# EasyEDA Pro project flight controller.eprj

# Schematic fcbychandan
Board Name: fcbychandan; Create Date: 2025-07-17; Page Name: fcbychandan; Project Name: flight controller; Schematic Name: fcbychandan; Update Date: 2025-10-28; File: fcbychandan; Id: /; Sheet: /; Title: fc
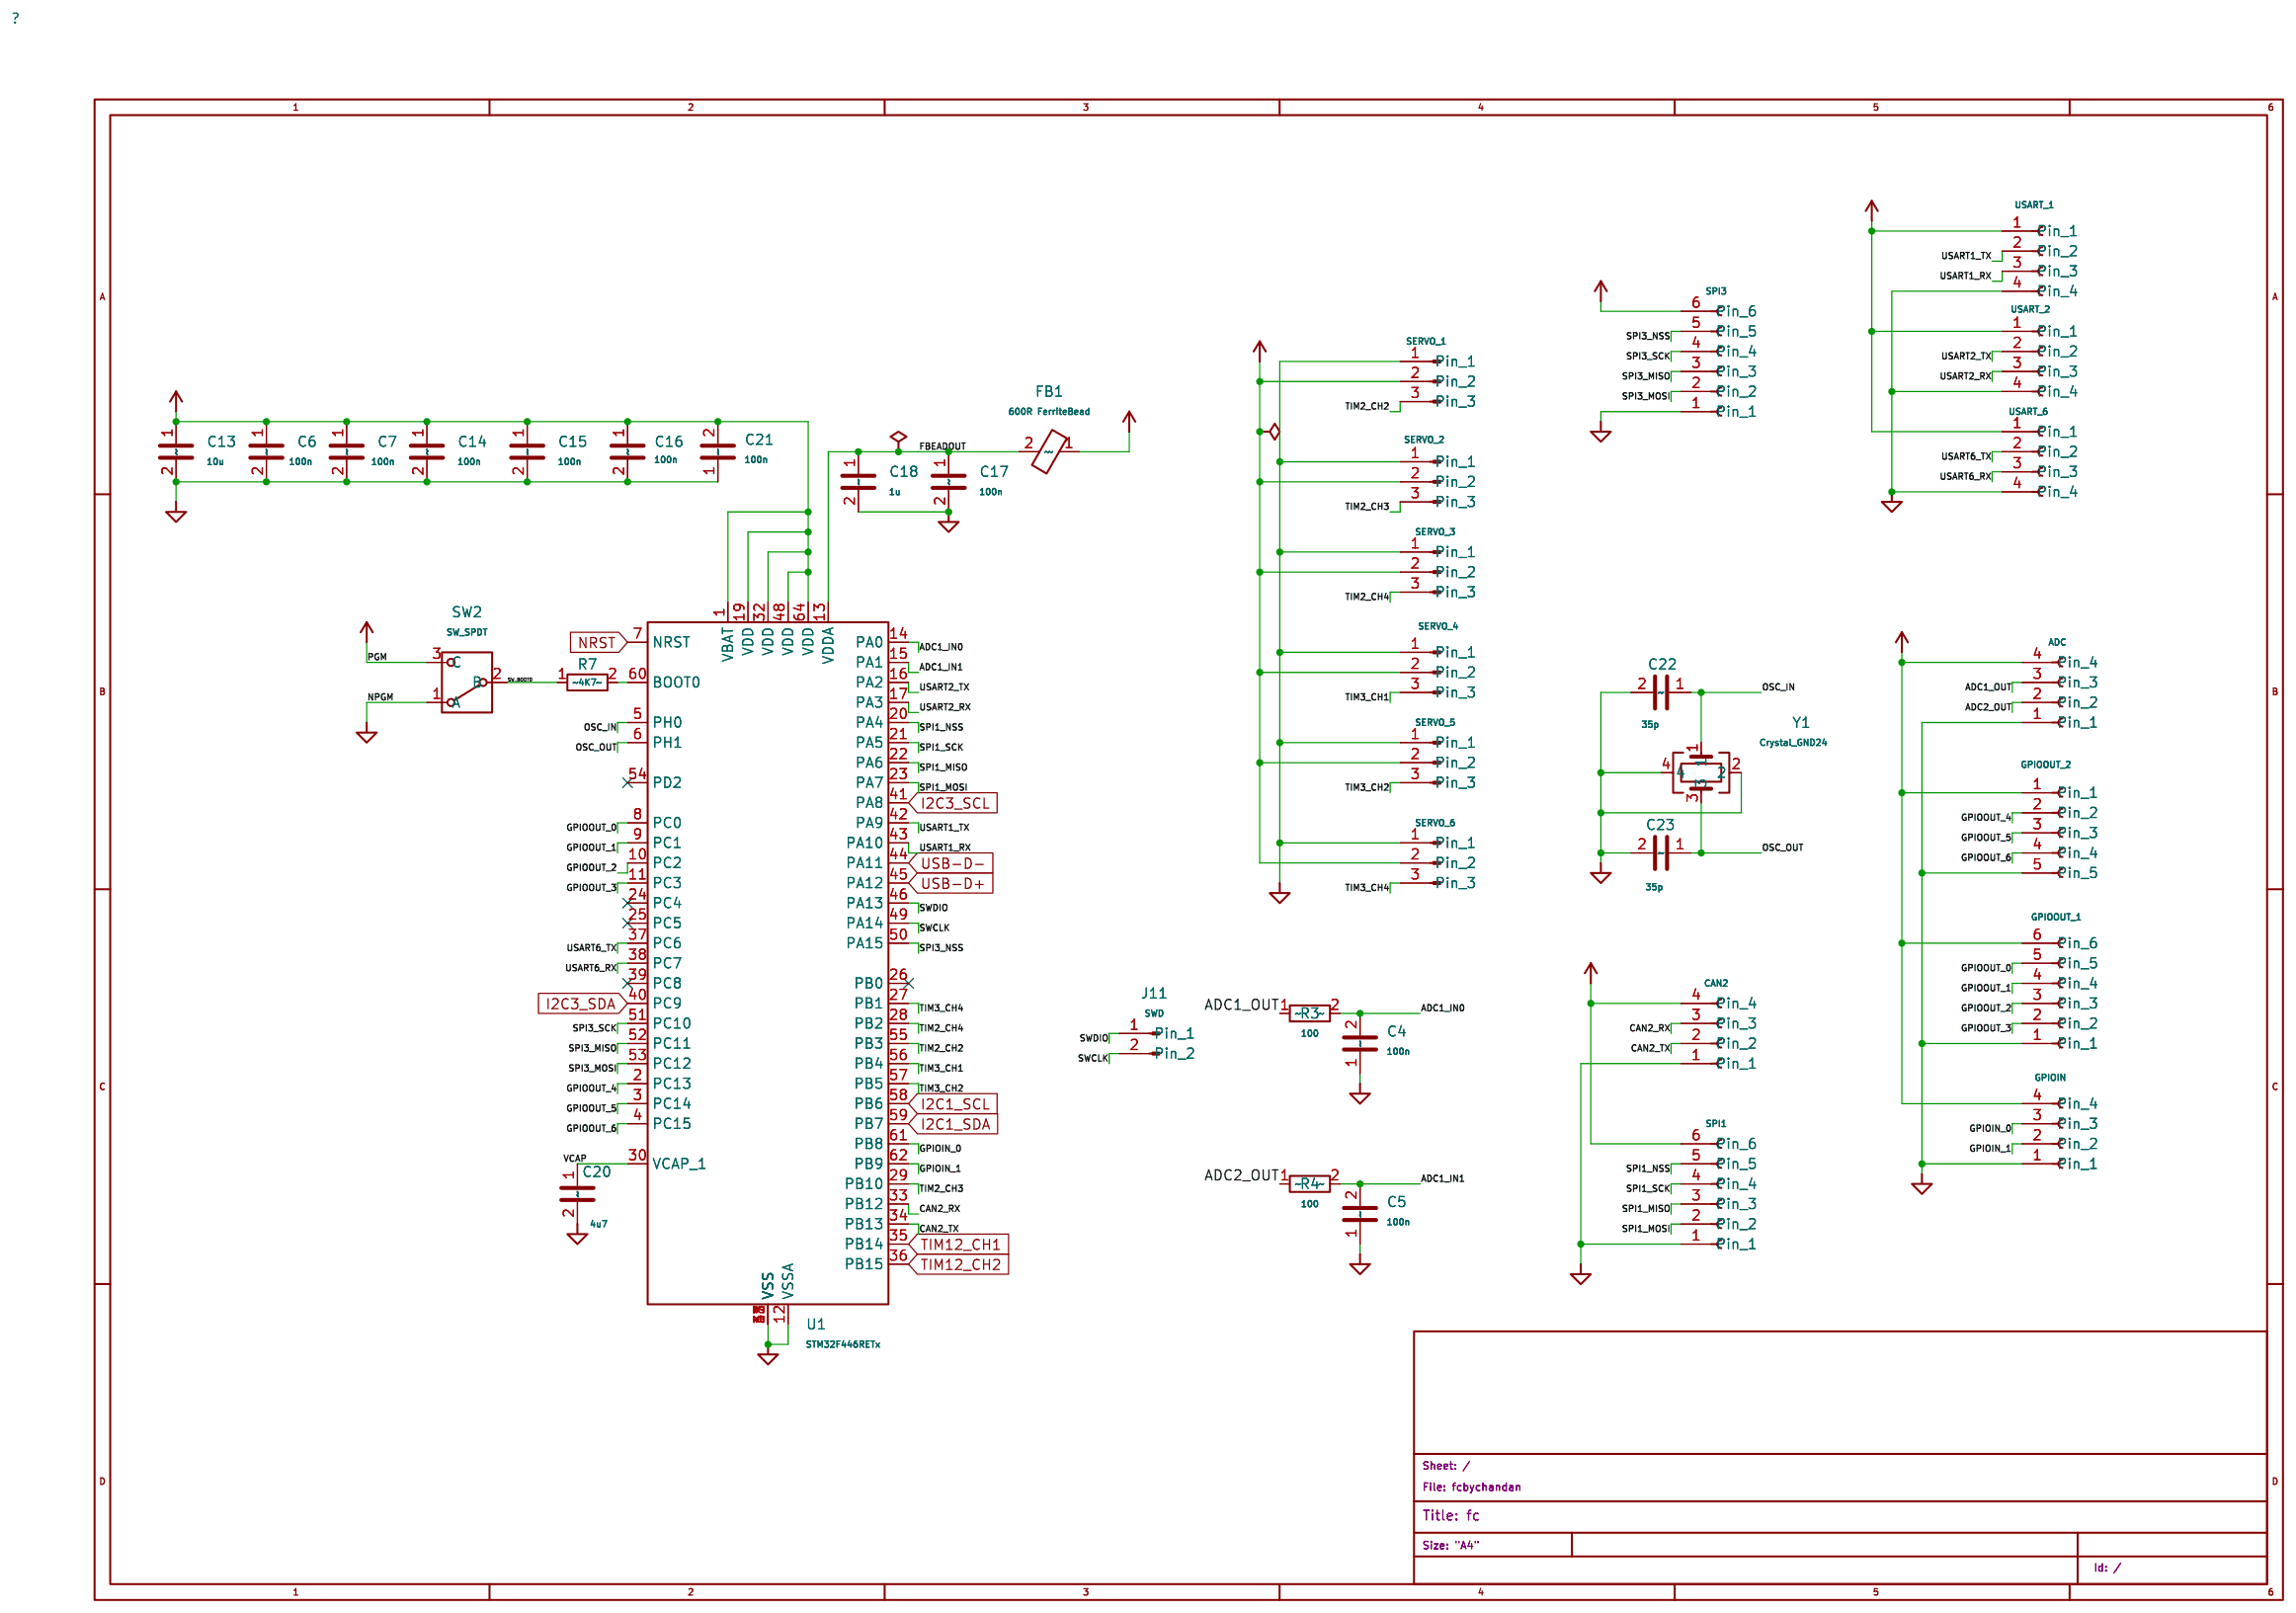
[diagram p0: schematic sheet]

## Parts
C4  100n
C5  100n
C6  100n
C7  100n
C13  10u
C14  100n
C15  100n
C16  100n
C17  100n
C18  1u
C20  4u7
C21  100n
C22  35p
C23  35p
FB1  600R FerriteBead
J1  SPI3
J2  GPIOOUT_1
J3  USART_1
J4  GPIOIN
J5  ADC
J6  USART_2
J7  USART_6
J8  SERVO_1
J9  SERVO_2
J10  GPIOOUT_2
J11  SWD
J12  SERVO_5
J13  SERVO_4
J14  SERVO_6
J15  SERVO_3
J17  SPI1
J18  CAN2
R3  100
R4  100
R7  4K7
SW2  SW_SPDT
U1  STM32F446RETx
Y1  Crystal_GND24

## Library data of the parts
C4-C7 C13-C18 C20-C23 = Device_C: Unpolarized capacitor
FB1 = Device_FerriteBead: Ferrite bead
J1 J2 J17 = Connector_Conn_01x06_Socket: Generic connector, single row, 01x06, script generated
J3-J7 J18 = Connector_Conn_01x04_Socket: Generic connector, single row, 01x04, script generated
J8 J9 J12-J15 = Connector_Conn_01x03_Pin: Generic connector, single row, 01x03, script generated
J10 = Connector_Conn_01x05_Socket: Generic connector, single row, 01x05, script generated
J11 = Connector_Conn_01x02_Pin: Generic connector, single row, 01x02, script generated
R3 R4 R7 = Device_R: Resistor
SW2 = Switch_SW_SPDT: Switch, single pole double throw
U1 = MCU_ST_STM32F4_STM32F446RETx: STMicroelectronics Arm Cortex-M4 MCU, 512KB flash, 128KB RAM, 180 MHz, 1.8-3.6V, 50 GPIO, LQFP64; User doc link: https://www.st.com/resource/en/datasheet/stm32f446re.pdf
Y1 = Device_Crystal_GND24: Four pin crystal, GND on pins 2 and 4

## Nets
ADC1_IN0: C4.2 R3.2 U1.14(PA0)
ADC1_IN1: C5.2 R4.2 U1.15(PA1)
ADC1_OUT: J5.3(Pin) R3.1
ADC2_OUT: J5.2(Pin) R4.1
CAN2_RX: J18.3(Pin) U1.33(PB12)
CAN2_TX: J18.2(Pin) U1.34(PB13)
GPIOIN_0: J4.3(Pin) U1.61(PB8)
GPIOIN_1: J4.2(Pin) U1.62(PB9)
GPIOOUT_0: J2.5(Pin) U1.8(PC0)
GPIOOUT_1: J2.4(Pin) U1.9(PC1)
GPIOOUT_2: J2.3(Pin) U1.10(PC2)
GPIOOUT_3: J2.2(Pin) U1.11(PC3)
GPIOOUT_4: J10.2(Pin) U1.2(PC13)
GPIOOUT_5: J10.3(Pin) U1.3(PC14)
GPIOOUT_6: J10.4(Pin) U1.4(PC15)
I2C1_SCL: U1.58(PB6)
I2C1_SDA: U1.59(PB7)
I2C3_SCL: U1.41(PA8)
I2C3_SDA: U1.40(PC9)
NRST: U1.7(NRST)
OSC_IN: C22.1 U1.5(PH0) Y1.1
OSC_OUT: C23.1 U1.6(PH1) Y1.3
POWER_+3.3V: J1.6(Pin) J2.6(Pin) J3.1(Pin) J4.4(Pin) J5.4(Pin) J6.1(Pin) J7.1(Pin) J10.1(Pin) J17.6(Pin) J18.4(Pin)
POWER_+3V3: C6.1 C7.1 C13.1 C14.1 C15.1 C16.1 C21.2 FB1.1 SW2.3(C) U1.1(VBAT) U1.19(VDD) U1.32(VDD) U1.48(VDD) U1.64(VDD)
POWER_+5V: C17.1 C18.1 FB1.2 J8.2(Pin) J9.2(Pin) J12.2(Pin) J13.2(Pin) J14.2(Pin) J15.2(Pin) U1.13(VDDA)
POWER_GND: C4.1 C5.1 C6.2 C7.2 C13.2 C14.2 C15.2 C16.2 C17.2 C18.2 C20.2 C21.1 C22.2 C23.2 J1.1(Pin) J2.1(Pin) J3.4(Pin) J4.1(Pin) J5.1(Pin) J6.4(Pin) J7.4(Pin) J8.1(Pin) J9.1(Pin) J10.5(Pin) J12.1(Pin) J13.1(Pin) J14.1(Pin) J15.1(Pin) J17.1(Pin) J18.1(Pin) SW2.1(A) U1.12(VSSA) U1.18(VSS) U1.31(VSS) U1.47(VSS) U1.63(VSS) Y1.2 Y1.4
SPI1_MISO: J17.3(Pin) U1.22(PA6)
SPI1_MOSI: J17.2(Pin) U1.23(PA7)
SPI1_NSS: J17.5(Pin) U1.20(PA4)
SPI1_SCK: J17.4(Pin) U1.21(PA5)
SPI3_MISO: J1.3(Pin) U1.52(PC11)
SPI3_MOSI: J1.2(Pin) U1.53(PC12)
SPI3_NSS: J1.5(Pin) U1.50(PA15)
SPI3_SCK: J1.4(Pin) U1.51(PC10)
SW_BOOT0: R7.1 SW2.2(B)
SWCLK: J11.2(Pin) U1.49(PA14)
SWDIO: J11.1(Pin) U1.46(PA13)
TIM2_CH2: J8.3(Pin) U1.55(PB3)
TIM2_CH3: J9.3(Pin) U1.29(PB10)
TIM2_CH4: J15.3(Pin) U1.28(PB2)
TIM3_CH1: J13.3(Pin) U1.56(PB4)
TIM3_CH2: J12.3(Pin) U1.57(PB5)
TIM3_CH4: J14.3(Pin) U1.27(PB1)
TIM12_CH1: U1.35(PB14)
TIM12_CH2: U1.36(PB15)
USART1_RX: J3.3(Pin) U1.43(PA10)
USART1_TX: J3.2(Pin) U1.42(PA9)
USART2_RX: J6.3(Pin) U1.17(PA3)
USART2_TX: J6.2(Pin) U1.16(PA2)
USART6_RX: J7.3(Pin) U1.38(PC7)
USART6_TX: J7.2(Pin) U1.37(PC6)
USB-D+: U1.45(PA12)
USB-D-: U1.44(PA11)
VCAP: C20.1 U1.30(VCAP_1)
Net-(R7-2): R7.2 U1.60(BOOT0)

Not connected (* = marked no-connect by the designer): U1 24(PC4)* 25(PC5)* 26(PB0)* 39(PC8)* 54(PD2)*

# Board fcbychandan
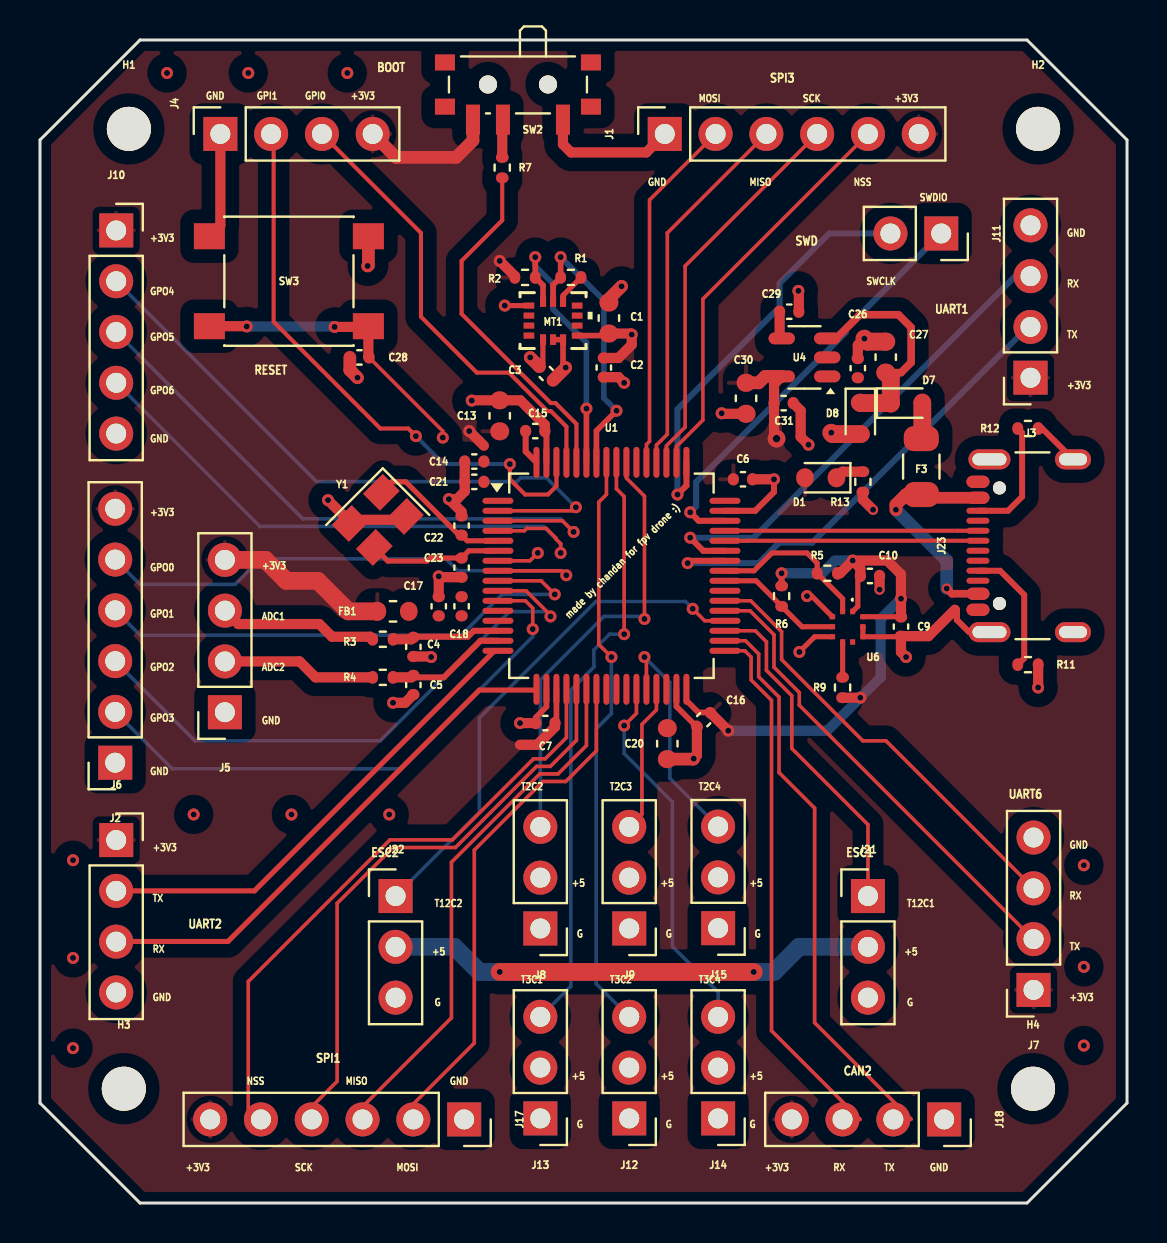
[diagram p1: board, top side]
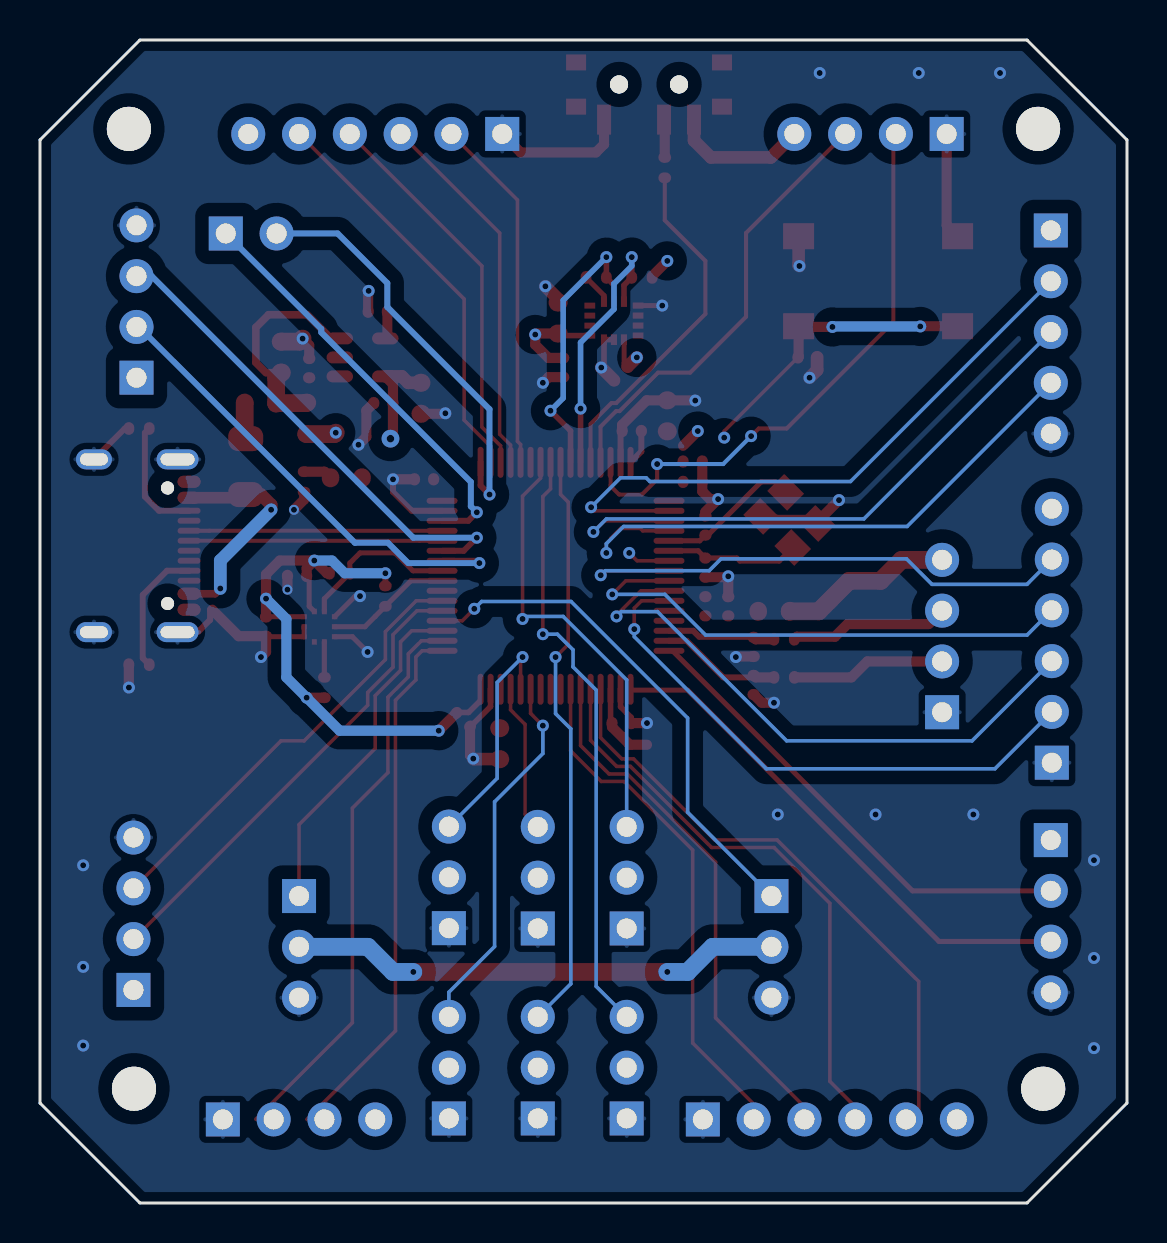
[diagram p2: board, bottom side, seen from below]

Outline 54.36 x 58.17 mm; copper layers: Top Layer, In1.Cu, In2.Cu, Bottom Layer. Coordinates in mm from the lower left corner of the outline.
Outline path: 0,53.17 5,58.17 49.36,58.17 54.36,53.17 54.36,5 49.36,0 5,0 0,5 0,53.17
Stack: Top Layer 0.0009mm / dielectric 1 0.0025mm FR4 er 4.5 / In1.Cu 0.0009mm / dielectric 2 0.0315mm FR4 er 4.5 / In2.Cu 0.0009mm / dielectric 3 0.0025mm FR4 er 4.5 / Bottom Layer 0.0009mm

## Design rules (mm)
spacing safeClearance (default): track to track 0.152, other pairs 0.152 to 0.3
track width trackWidth (default): min 0.127, default 0.254, max 2.54
differential pair differentialPair (default): width min 0.127, default 0.254, max 2.54; gap min 0.152, default 0.152
via viaSize (default): diameter min 0.5, default 0.61, max 10; hole min 0.3, default 0.305, max 6
net GND uses CopperRegion9
net /Fbeadout uses CopperRegion1
net /POWER SUPPLY/5Vin uses CopperRegion2
net 3V3 uses CopperRegion3
net /VCAP uses CopperRegion4
net VCC (+5) uses CopperRegion6
pour ie1435 uses CopperRegion
pour ie1436 uses CopperRegion8
pour ie1437 uses CopperRegion7
pour ie1439 uses CopperRegion2
pour ie1441 uses CopperRegion1
pour ie1442 uses CopperRegion4

## Placement (name value [footprint] x y rotation side)
C1  2u2  [Capacitor_SMD:C_0603_1608Metric]  28.45 44.26 90 top
C2  100n  [Capacitor_SMD:C_0402_1005Metric]  28.19 41.78 270 top
C3  10n  [Capacitor_SMD:C_0402_1005Metric]  25.31 41.49 315 top
C4  100n  [Capacitor_SMD:C_0402_1005Metric]  18.67 27.81 90 top
C5  100n  [Capacitor_SMD:C_0402_1005Metric]  18.67 25.91 90 top
C6  100n  [Capacitor_SMD:C_0402_1005Metric]  35.15 36.19 0 top
C7  100n  [Capacitor_SMD:C_0402_1005Metric]  25.27 24 180 top
C9  100n  [Capacitor_SMD:C_0402_1005Metric]  43.05 28.83 270 top
C10  100n  [Capacitor_SMD:C_0402_1005Metric]  41.5 31.36 0 top
C13  10u  [Capacitor_SMD:C_0603_1608Metric]  22.99 39.37 90 top
C14  100n  [Capacitor_SMD:C_0402_1005Metric]  21.72 37.08 180 top
C15  100n  [Capacitor_SMD:C_0402_1005Metric]  24.77 38.61 0 top
C16  100n  [Capacitor_SMD:C_0402_1005Metric]  33.19 24.17 225 top
C17  100n  [Capacitor_SMD:C_0402_1005Metric]  19.94 29.84 90 top
C18  1u  [Capacitor_SMD:C_0402_1005Metric]  21.08 29.84 90 top
C20  4u7  [Capacitor_SMD:C_0603_1608Metric]  31.37 22.97 270 top
C21  100n  [Capacitor_SMD:C_0402_1005Metric]  21.72 36.07 0 top
C22  35p  [Capacitor_SMD:C_0402_1005Metric]  21.08 33.88 90 top
C23  35p  [Capacitor_SMD:C_0402_1005Metric]  21.08 31.78 270 top
C26  100n  [Capacitor_SMD:C_0402_1005Metric]  40.89 41.75 90 top
C27  2u2  [Capacitor_SMD:C_0603_1608Metric]  42.29 42.3 90 top
C28  100n  [Capacitor_SMD:C_0402_1005Metric]  15.97 42.29 180 top
C29  10n  [Capacitor_SMD:C_0402_1005Metric]  37.46 44.58 0 top
C30  2u2  [Capacitor_SMD:C_0603_1608Metric]  35.31 40.25 270 top
C31  100n  [Capacitor_SMD:C_0402_1005Metric]  37.19 40 0 top
D1  GRN  [LED_SMD:LED_0603_1608Metric]  39.04 36.27 180 top
D7  B120-E3  [Diode_SMD:D_0603_1608Metric]  43.33 40 0 top
D8  B120-E3  [Diode_SMD:D_0603_1608Metric]  41.02 39.24 270 top
F3  Fuse  [Fuse:Fuse_1206_3216Metric]  44.07 36.83 270 top
FB1  600R FerriteBead  [Inductor_SMD:L_0603_1608Metric]  17.65 29.59 0 top
H1  MountingHole  [MountingHole:MountingHole_2.2mm_M2]  4.45 53.72 0 top
H2  MountingHole  [MountingHole:MountingHole_2.2mm_M2]  49.91 53.72 0 top
H3  MountingHole  [MountingHole:MountingHole_2.2mm_M2]  4.19 5.72 0 top
H4  MountingHole  [MountingHole:MountingHole_2.2mm_M2]  49.66 5.72 0 top
J1  SPI3  [Connector_PinSocket_2.54mm:PinSocket_1x06_P2.54mm_Vertical]  31.24 53.47 90 top
J2  GPIOOUT_1  [Connector_PinSocket_2.54mm:PinSocket_1x06_P2.54mm_Vertical]  3.76 22.02 180 top
J3  USART_1  [Connector_PinSocket_2.54mm:PinSocket_1x04_P2.54mm_Vertical]  49.53 41.28 180 top
J4  GPIOIN  [Connector_PinSocket_2.54mm:PinSocket_1x04_P2.54mm_Vertical]  9.02 53.47 90 top
J5  ADC  [Connector_PinSocket_2.54mm:PinSocket_1x04_P2.54mm_Vertical]  9.25 24.55 180 top
J6  USART_2  [Connector_PinSocket_2.54mm:PinSocket_1x04_P2.54mm_Vertical]  3.81 18.15 0 top
J7  USART_6  [Connector_PinSocket_2.54mm:PinSocket_1x04_P2.54mm_Vertical]  49.68 10.66 180 top
J8  SERVO_1  [Connector_PinHeader_2.54mm:PinHeader_1x03_P2.54mm_Vertical]  25.02 13.73 180 top
J9  SERVO_2  [Connector_PinHeader_2.54mm:PinHeader_1x03_P2.54mm_Vertical]  29.46 13.73 180 top
J10  GPIOOUT_2  [Connector_PinSocket_2.54mm:PinSocket_1x05_P2.54mm_Vertical]  3.81 48.64 0 top
J11  SWD  [Connector_PinSocket_2.54mm:PinSocket_1x02_P2.54mm_Vertical]  45.07 48.49 270 top
J12  SERVO_5  [Connector_PinHeader_2.54mm:PinHeader_1x03_P2.54mm_Vertical]  29.46 4.23 180 top
J13  SERVO_4  [Connector_PinHeader_2.54mm:PinHeader_1x03_P2.54mm_Vertical]  25.02 4.23 180 top
J14  SERVO_6  [Connector_PinHeader_2.54mm:PinHeader_1x03_P2.54mm_Vertical]  33.91 4.23 180 top
J15  SERVO_3  [Connector_PinHeader_2.54mm:PinHeader_1x03_P2.54mm_Vertical]  33.91 13.75 180 top
J17  SPI1  [Connector_PinSocket_2.54mm:PinSocket_1x06_P2.54mm_Vertical]  21.21 4.18 270 top
J18  CAN2  [Connector_PinSocket_2.54mm:PinSocket_1x04_P2.54mm_Vertical]  45.21 4.18 270 top
J21  B1_IN  [Connector_PinHeader_2.54mm:PinHeader_1x03_P2.54mm_Vertical]  41.4 15.35 0 top
J22  B2_IN  [Connector_PinHeader_2.54mm:PinHeader_1x03_P2.54mm_Vertical]  17.78 15.35 0 top
J23  USB_IN  [Connector_USB:USB_C_Receptacle_GCT_USB4105-xx-A_16P_TopMnt_Horizontal]  50.58 32.87 90 top
MT1  ICM-42670-P  [Littelfuse_poly:LGA14_2.5X3X0.76_IVS]  25.65 44.13 0 top
R1  10K  [Resistor_SMD:R_0402_1005Metric]  26.54 46.29 180 top
R2  10K  [Resistor_SMD:R_0402_1005Metric]  24.26 46.29 0 top
R3  100  [Resistor_SMD:R_0402_1005Metric]  17.14 28.19 0 top
R4  100  [Resistor_SMD:R_0402_1005Metric]  17.14 26.29 0 top
R5  4K7  [Resistor_SMD:R_0402_1005Metric]  39.37 31.5 180 top
R6  4K7  [Resistor_SMD:R_0402_1005Metric]  37.08 30.35 90 top
R7  4K7  [Resistor_SMD:R_0402_1005Metric]  23.11 51.78 270 top
R9  100K  [Resistor_SMD:R_0402_1005Metric]  40.13 25.78 270 top
R11  4K7  [Resistor_SMD:R_0402_1005Metric]  49.4 26.92 0 top
R12  4K7  [Resistor_SMD:R_0402_1005Metric]  49.4 38.73 0 top
R13  4K7  [Resistor_SMD:R_0402_1005Metric]  41.15 36.07 270 top
SW2  SW_SPDT  [Button_Switch_SMD:SW_SPDT_PCM12]  23.9 55.61 180 top
SW3  SW_Push  [Button_Switch_SMD:SW_Push_1P1T_NO_6x6mm_H9.5mm]  12.45 46.1 0 top
U1  STM32F446RETx  [Package_QFP:LQFP-64_10x10mm_P0.5mm]  28.58 31.37 0 top
U4  3V3  [Package_TO_SOT_SMD:SOT-23-5]  38.23 42.29 180 top
U6  BMP390  [Littelfuse_poly:BMP390]  40.39 28.82 0 top
Y1  Crystal_GND24  [Crystal:Crystal_SMD_3225-4Pin_3.2x2.5mm]  16.89 34.16 225 top

## Footprints (pads in the part's own frame, mm; a bottom-side part is the same pattern mirrored in y, then rotated)
Button_Switch_SMD:SW_Push_1P1T_NO_6x6mm_H9.5mm
  rect 1.55x1.3 smd: 1(-3.975,2.25) 1(3.975,2.25) 2(-3.975,-2.25) 2(3.975,-2.25)
Button_Switch_SMD:SW_SPDT_PCM12
  rect 1x0.8 smd: (-3.65,0.78) (-3.65,-1.43) (3.65,0.78) (3.65,-1.43)
  round 0.9 hole 0.9: (-1.5,-0.33) (1.5,-0.33)
  rect 0.7x1.5 smd: 1(-2.25,1.43) 2(0.75,1.43) 3(2.25,1.43)
Capacitor_SMD:C_0402_1005Metric
  rrect 0.56x0.62 smd: 1(-0.48,0) 2(0.48,0)
Capacitor_SMD:C_0603_1608Metric
  rrect 0.9x0.95 smd: 1(-0.775,0) 2(0.775,0)
Connector_PinHeader_2.54mm:PinHeader_1x03_P2.54mm_Vertical
  rect 1.7x1.7 hole 1: 1(0,0)
  round 1.7 hole 1: 2(0,-2.54) 3(0,-5.08)
Connector_PinSocket_2.54mm:PinSocket_1x02_P2.54mm_Vertical
  rect 1.7x1.7 hole 1: 1(0,0)
  round 1.7 hole 1: 2(0,-2.54)
Connector_PinSocket_2.54mm:PinSocket_1x04_P2.54mm_Vertical
  rect 1.7x1.7 hole 1: 1(0,0)
  round 1.7 hole 1: 2(0,-2.54) 3(0,-5.08) 4(0,-7.62)
Connector_PinSocket_2.54mm:PinSocket_1x05_P2.54mm_Vertical
  rect 1.7x1.7 hole 1: 1(0,0)
  round 1.7 hole 1: 2(0,-2.54) 3(0,-5.08) 4(0,-7.62) 5(0,-10.16)
Connector_PinSocket_2.54mm:PinSocket_1x06_P2.54mm_Vertical
  rect 1.7x1.7 hole 1: 1(0,0)
  round 1.7 hole 1: 2(0,-2.54) 3(0,-5.08) 4(0,-7.62) 5(0,-10.16) 6(0,-12.7)
Connector_USB:USB_C_Receptacle_GCT_USB4105-xx-A_16P_TopMnt_Horizontal
  round 0.65 hole 0.65: (-2.89,2.605) (2.89,2.605)
  rrect 0.6x1.15 smd: A1(-3.2,3.68) A4(-2.4,3.68) A9(2.4,3.68) A12(3.2,3.68) B1(3.2,3.68) B4(2.4,3.68) B9(-2.4,3.68) B12(-3.2,3.68)
  rrect 0.3x1.15 smd: A5(-1.25,3.68) A6(-0.25,3.68) A7(0.25,3.68) A8(1.25,3.68) B5(1.75,3.68) B6(0.75,3.68) B7(-0.75,3.68) B8(-1.75,3.68)
  oval 1x2.1 hole 0.6x1.7: S1(-4.32,3.105) S1(4.32,3.105)
  oval 1x1.8 hole 0.6x1.4: S1(-4.32,-1.075) S1(4.32,-1.075)
Crystal:Crystal_SMD_3225-4Pin_3.2x2.5mm
  rect 1.4x1.2 smd: 1(-1.1,-0.85) 2(1.1,-0.85) 3(1.1,0.85) 4(-1.1,0.85)
Diode_SMD:D_0603_1608Metric
  rrect 0.875x0.95 smd: 1(-0.787,0) 2(0.787,0)
Fuse:Fuse_1206_3216Metric
  rrect 1.25x1.75 smd: 1(-1.4,0) 2(1.4,0)
Inductor_SMD:L_0603_1608Metric
  rrect 0.875x0.95 smd: 1(-0.787,0) 2(0.787,0)
LED_SMD:LED_0603_1608Metric
  rrect 0.875x0.95 smd: 1(-0.787,0) 2(0.787,0)
Littelfuse_poly:BMP390
  rect 0.25x0.275 smd: 1(0.25,0.763) 2(-0.25,0.763) 6(-0.25,-0.763) 7(0.25,-0.763)
  rect 0.275x0.25 smd: 3(-0.762,0.5) 4(-0.762,0) 5(-0.762,-0.5) 8(0.762,-0.5) 9(0.762,0) 10(0.762,0.5)
Littelfuse_poly:LGA14_2.5X3X0.76_IVS
  rect 0.533x0.305 smd: 1(-1.206,0.75) 2(-1.206,0.25) 3(-1.206,-0.25) 4(-1.206,-0.75) 8(1.206,-0.75) 9(1.206,-0.25) 10(1.206,0.25) 11(1.206,0.75)
  rect 0.305x0.533 smd: 5(-0.5,-0.953) 6(0,-0.953) 7(0.5,-0.953) 12(0.5,0.953) 13(0,0.953) 14(-0.5,0.953)
MountingHole:MountingHole_2.2mm_M2
  round 2.2 hole 2.2: (0,0)
Package_QFP:LQFP-64_10x10mm_P0.5mm
  rrect 1.55x0.3 smd: 1(-5.675,3.75) 2(-5.675,3.25) 3(-5.675,2.75) 4(-5.675,2.25) 5(-5.675,1.75) 6(-5.675,1.25) 7(-5.675,0.75) 8(-5.675,0.25) 9(-5.675,-0.25) 10(-5.675,-0.75) 11(-5.675,-1.25) 12(-5.675,-1.75) 13(-5.675,-2.25) 14(-5.675,-2.75) 15(-5.675,-3.25) 16(-5.675,-3.75) 33(5.675,-3.75) 34(5.675,-3.25) 35(5.675,-2.75) 36(5.675,-2.25) 37(5.675,-1.75) 38(5.675,-1.25) 39(5.675,-0.75) 40(5.675,-0.25) 41(5.675,0.25) 42(5.675,0.75) 43(5.675,1.25) 44(5.675,1.75) 45(5.675,2.25) 46(5.675,2.75) 47(5.675,3.25) 48(5.675,3.75)
  rrect 0.3x1.55 smd: 17(-3.75,-5.675) 18(-3.25,-5.675) 19(-2.75,-5.675) 20(-2.25,-5.675) 21(-1.75,-5.675) 22(-1.25,-5.675) 23(-0.75,-5.675) 24(-0.25,-5.675) 25(0.25,-5.675) 26(0.75,-5.675) 27(1.25,-5.675) 28(1.75,-5.675) 29(2.25,-5.675) 30(2.75,-5.675) 31(3.25,-5.675) 32(3.75,-5.675) 49(3.75,5.675) 50(3.25,5.675) 51(2.75,5.675) 52(2.25,5.675) 53(1.75,5.675) 54(1.25,5.675) 55(0.75,5.675) 56(0.25,5.675) 57(-0.25,5.675) 58(-0.75,5.675) 59(-1.25,5.675) 60(-1.75,5.675) 61(-2.25,5.675) 62(-2.75,5.675) 63(-3.25,5.675) 64(-3.75,5.675)
Package_TO_SOT_SMD:SOT-23-5
  rrect 1.325x0.6 smd: 1(-1.137,0.95) 2(-1.137,0) 3(-1.137,-0.95) 4(1.137,-0.95) 5(1.137,0.95)
Resistor_SMD:R_0402_1005Metric
  rrect 0.54x0.64 smd: 1(-0.51,0) 2(0.51,0)

## Nets
3V3: C1.1 C2.1 C3.1 C6.1 C7.1 C9.1 C10.1 C13.1 C14.1 C15.1 C16.1 C21.2 C30.1 C31.1 D1.2 FB1.1 J1.6 J2.6 J3.1 J4.4 J5.4 J6.1 J7.1 J10.1 J17.6 J18.4 MT1.5 MT1.8 MT1.12 R1.1 R2.1 R5.1 R6.2 R9.2 SW2.3 U1.1 U1.19 U1.32 U1.48 U1.64 U4.5 U6.1 U6.10
/POWER SUPPLY/5VIN: C26.1 C27.1 D7.1 D8.1 U4.1 U4.3
/POWER SUPPLY/5VUSB: F3.2 J23.A4 J23.A9 J23.B4 J23.B9
GND: C1.2 C2.2 C3.2 C4.1 C5.1 C6.2 C7.2 C9.2 C10.2 C13.2 C14.2 C15.2 C16.2 C17.2 C18.2 C20.2 C21.1 C22.2 C23.2 C26.2 C27.2 C28.2 C29.2 C30.2 C31.2 J1.1 J2.1 J3.4 J4.1 J5.1 J6.4 J7.4 J8.1 J9.1 J10.5 J12.1 J13.1 J14.1 J15.1 J17.1 J18.1 J21.3 J22.3 J23.A1 J23.A12 J23.B1 J23.B12 J23.S1 MT1.1 MT1.6 MT1.7 R11.2 R12.2 R13.2 SW2.1 SW3.1 U1.12 U1.18 U1.31 U1.47 U1.63 U4.2 U6.3 U6.5 U6.8 U6.9 Y1.2 Y1.4
VCC (+5): D8.2 J8.2 J9.2 J12.2 J13.2 J14.2 J15.2 J21.2 J22.2
/ADC1_IN0: C4.2 R3.2 U1.14
/ADC1_IN1: C5.2 R4.2 U1.15
/ADC1_OUT: J5.3 R3.1
/ADC2_OUT: J5.2 R4.1
/CAN2_RX: J18.3 U1.33
/CAN2_TX: J18.2 U1.34
/FBEADOUT: C17.1 C18.1 FB1.2 U1.13
/GPIOIN_0: J4.3 U1.61
/GPIOIN_1: J4.2 U1.62
/GPIOOUT_0: J2.5 U1.8
/GPIOOUT_1: J2.4 U1.9
/GPIOOUT_2: J2.3 U1.10
/GPIOOUT_3: J2.2 U1.11
/GPIOOUT_4: J10.2 U1.2
/GPIOOUT_5: J10.3 U1.3
/GPIOOUT_6: J10.4 U1.4
/OSC_IN: C22.1 U1.5 Y1.1
/OSC_OUT: C23.1 U1.6 Y1.3
/POWER SUPPLY/BP: C29.1 U4.4
/POWER SUPPLY/CC1USB: J23.A5 R11.1
/POWER SUPPLY/CC2USB: J23.B5 R12.1
/SPI1_MISO: J17.3 U1.22
/SPI1_MOSI: J17.2 U1.23
/SPI1_NSS: J17.5 U1.20
/SPI1_SCK: J17.4 U1.21
/SPI3_MISO: J1.3 U1.52
/SPI3_MOSI: J1.2 U1.53
/SPI3_NSS: J1.5 U1.50
/SPI3_SCK: J1.4 U1.51
/SW_BOOT0: R7.1 SW2.2
/SWCLK: J11.2 U1.49
/SWDIO: J11.1 U1.46
/TIM2_CH2: J8.3 U1.55
/TIM2_CH3: J9.3 U1.29
/TIM2_CH4: J15.3 U1.28
/TIM3_CH1: J13.3 U1.56
/TIM3_CH2: J12.3 U1.57
/TIM3_CH4: J14.3 U1.27
/USART1_RX: J3.3 U1.43
/USART1_TX: J3.2 U1.42
/USART2_RX: J6.3 U1.17
/USART2_TX: J6.2 U1.16
/USART6_RX: J7.3 U1.38
/USART6_TX: J7.2 U1.37
/VCAP: C20.1 U1.30
I2C1_SCL: MT1.13 R1.2 U1.58
I2C1_SDA: MT1.14 R2.2 U1.59
I2C3_SCL: R5.2 U1.41 U6.2
I2C3_SDA: R6.1 U1.40 U6.4
NET-(D1-K): D1.1 R13.1
NET-(D7-A): D7.2 F3.1
NET-(U1-BOOT0): R7.2 U1.60
NET-(U6-CSB): R9.1 U6.6
NRST: C28.1 SW3.2 U1.7
TIM12_CH1: J21.1 U1.35
TIM12_CH2: J22.1 U1.36
UNCONNECTED-(MT1-INT1{SLASH}INT-PAD4): MT1.4
UNCONNECTED-(MT1-INT2-PAD9): MT1.9
UNCONNECTED-(MT1-RESV-PAD2): MT1.2
UNCONNECTED-(MT1-RESV__1-PAD3): MT1.3
UNCONNECTED-(MT1-RESV__2-PAD10): MT1.10
UNCONNECTED-(MT1-RESV__3-PAD11): MT1.11
UNCONNECTED-(U1-PB0-PAD26): U1.26
UNCONNECTED-(U1-PC4-PAD24): U1.24
UNCONNECTED-(U1-PC5-PAD25): U1.25
UNCONNECTED-(U1-PC8-PAD39): U1.39
UNCONNECTED-(U1-PD2-PAD54): U1.54
UNCONNECTED-(U6-INT-PAD7): U6.7
USB-D+: J23.A6 J23.B6 U1.45
USB-D-: J23.A7 J23.B7 U1.44

Pads without a net: J23 A8 B8

## Via types
v1: diameter 0.6, hole 0.3, Top Layer to Bottom Layer, 74 vias
v2: diameter 0.5, hole 0.3, Top Layer to Bottom Layer, 4 vias
v3: diameter 0.889, hole 0.381, Top Layer to Bottom Layer, 1 via

## Routing (per net, layer and track width the routed paths; a pad name or vN(x,y) marks a point on that pad's centre or on a via; arc(x,y) is an arc through that point)
3V3: length 294.7
  Top Layer w0.254: U6.10 43.04,29.32 ; R1.1 26.15,45.39 MT1.12 ; U6.1 40.89,29.84 40.89,31.23 ; 25.15,43.17 25.15,42 C3.1
  Top Layer w0.28: 32.33,25.13 32.92,24.53 33.51,24.53 ; MT1.8 28.35,43.38 ; 25.83,24.08 U1.19
  Top Layer w0.297: C15.1 24.29,37.58 U1.64
  Top Layer w0.305: R6.2 v1(37.08,31.5)
  Top Layer w0.508: C1.1 29.54,43.48 v1(29.59,43.43) 29.59,42.93 28.93,42.26 C2.1 ; v1(40.64,32.13) 42.36,32.13 43.05,31.44 v1(43.05,30.23) C9.1 ; v1(40.64,32.13) 40.01,31.5 R5.1 ; v1(40.64,32.13) 41.02,31.75 C10.1 ; v1(41.02,25.27) 41.02,25.27 R9.2 ; v1(21.46,38.61) 22.2,37.87 ; C7.1 25.75,23.81 24.86,22.92 24,22.92 ; v3(36.83,38.23) 36.71,38.35 C31.1 36.71,40.96 U4.5 ; C16.1 v1(34.42,23.62) ; 23.74,46.36 v1(22.99,47.12)
  Top Layer w0.635: U4.5 36.26,41.34 35.94,41.02 C30.1 ; SW2.3 21.65,53.14 20.8,52.29 17.81,52.29 J4.4 ; C3.1 v1(24.51,42.29)
  Top Layer w0.889: J5.4 11.27,32.17 12.32,31.11 13.89,31.11 15.42,29.59 FB1.1
  In2.Cu w0.508: v1(21.46,38.61) 18.67,41.4 18.67,51.44 J4.4
  In2.Cu w0.635: v1(29.59,43.43) 30.19,44.03 30.19,48.2 28.73,49.66 28.73,56.01 ; v1(24.51,42.29) 24.22,42.29 21.72,44.8 21.72,45.85 v1(22.99,47.12) J4.4
  In2.Cu w1.27: 43.94,53.49 47.5,49.94 47.5,41.15 ; 47.5,41.15 49.4,41.15 J3.1 ; 47.5,41.15 39.12,41.15 36.83,38.86 v3(36.83,38.23)
  In2.Cu w1.524: 1.4,34.8 1.4,20.56 J6.1 4.84,18.15 8.51,14.48 8.51,2.92 9.91,1.52 36.7,1.52 37.59,2.41 37.59,5.08 39.24,6.73 43.94,6.73 47.87,10.66 J7.1 ; 1.4,34.8 1.4,46.37 3.67,48.64 J10.1 5.21,50.04 14.48,50.04 16.64,52.2 J4.4 16.96,53.79 26.51,53.79 28.73,56.01 42.29,56.01 43.94,54.36 J1.6 ; 1.4,34.8 1.47,34.72 J2.6 6.69,34.72 J5.4
  Bottom Layer w0.508: v1(37.08,31.5) 39.12,31.5 39.75,32.13 v1(40.64,32.13) ; v1(43.05,30.23) 42.04,29.21 42.04,26.29 v1(41.02,25.27) 39.37,23.62 v1(34.42,23.62)
/POWER SUPPLY/5VIN: length 10.9
  Top Layer w0.381: 39.81,43.24 41,44.42 42.93,44.42 43.56,43.79 43.56,42.04 43.05,41.53 C27.1
  Top Layer w0.889: D8.1 41.05,40 D7.1 42.55,41.28 C27.1
/POWER SUPPLY/5VUSB: length 10.9
  Top Layer w0.381: v2(45.34,30.73) 45.6,30.47 J23.A4
  Top Layer w0.584: 44.23,35.27 46.72,35.27
  Top Layer w0.635: F3.2 43.3,35.43 42.8,34.92 v2(42.8,34.67)
  Bottom Layer w0.635: v2(45.34,30.73) 45.34,32.13 v2(42.8,34.67)
GND: length 75.3
  Top Layer w0.254: v1(37.97,27.56) 38.73,28.32 U6.5 ; v1(38.35,30.35) 38.59,30.35 U6.3 ; U6.9 U6.8 43.02,28.32 ; v1(23.24,44.88) MT1.1
  Top Layer w0.28: U1.31 31.83,24.83 32.82,23.83 ; MT1.6 MT1.7 26.15,41.92 v1(26.29,41.78) ; C7.2 24.79,24.28 25.32,24.82 U1.18
  Top Layer w0.297: 51.66,37.19 50.11,38.73 R12.2
  Top Layer w0.298: v1(36.7,36.19) 36.7,35.56 35.76,34.62 U1.47 ; U1.63 25.32,38.53
  Top Layer w0.305: 45.85,29.67 45.85,29.16 46.46,28.55
  Top Layer w0.508: v1(38.43,37.92) 38.04,38.32 38.04,39.63 C31.2 ; 45.75,29.67 44.42,28.35 C9.2 43.05,27.56 v1(43.31,27.3) ; C26.2 40.89,42.9 v1(41.22,43.23) ; C15.2 25.24,38.92 24.02,40.14 C13.2 21.6,40.14 v1(21.59,40.13) ; C4.1 19.53,27.33 v1(19.56,27.3) ; C7.2 v1(24,24) ; C17.2 v1(19.94,31.34) 19.98,31.3 C23.2 ; 18.1,34.17 15.69,34.17 ; v1(29.21,41.02) 28.93,41.3 C2.2 ; C29.2 37.94,45.6 v1(37.92,45.62) ; v2(41.98,30.68) C10.2 ; J4.1 9.02,48.9 8.47,48.35 ; C22.2 21.08,34.57 v1(20.45,35.2) 20.85,35.2 21.24,35.59 C21.1 C14.2 ; v1(17.65,25.02) 18.26,25.02 C5.1 ; v1(32.69,22.22) 32.85,22.38 C16.2 ; J1.1 30.32,52.54 26.55,52.54 26.15,52.95 SW2.1 ; v1(34.09,39.5) 34.11,39.47 C30.2 ; 35.63,36.19 v1(36.7,36.19) ; R13.2 41.15,35.18 v2(41.66,34.67) ; 15.51,34.04 v1(14.4,35.15) ; R11.2 49.91,25.78
  Top Layer w0.635: C20.2 32.66,22.2 v1(32.69,22.22) ; v1(15.88,41.28) 15.49,41.66 C28.2 ; C3.2 v1(26.29,41.78) ; v1(16.38,46.86) 16.42,46.9 SW3.1 ; 28.45,45.21 v1(29.08,45.85)
  Top Layer w0.889: v1(41.22,43.23) 41.38,43.08 C27.2
  vias: v1(1.65,17.14) v1(1.65,12.26) v1(1.65,7.75) v1(6.35,56.52) v1(7.68,19.43) v1(10.41,56.52) v1(12.57,19.43) v1(15.37,56.52) v1(17.46,19.43) v1(49.91,25.78) v1(52.2,16.89) v1(52.2,11.81) v1(52.2,7.87)
VCC (+5): length 26.1
  Top Layer w0.889: D8.2 39.64,38.46 v1(39.57,38.53) ; v1(22.99,11.56) v1(35.69,11.56)
  Bottom Layer w0.889: v1(22.99,11.56) 21.97,11.56 20.72,12.81 J22.2 ; J21.2 37.96,12.81 36.7,11.56 v1(35.69,11.56)
/ADC1_IN0: length 5.4
  Top Layer w0.298: 18.7,28.32 21.39,28.32 21.69,28.62 U1.14
  Top Layer w0.508: C4.2 18.57,28.19 17.65,28.19
/ADC1_IN1: length 5.9
  Top Layer w0.298: 18.77,26.29 20.19,26.29 22.02,28.12 U1.15
  Top Layer w0.508: C5.2 18.57,26.29 R4.2
/ADC1_OUT: length 8
  Top Layer w0.508: R3.1 16.51,28.32 14.61,28.32 13.97,28.96 9.92,28.96 J5.3
/ADC2_OUT: length 7.7
  Top Layer w0.508: J5.2 12.98,27.09 13.78,26.29 R4.1
/CAN2_RX: length 26.8
  Top Layer w0.178: 41.01,4.18 36.58,8.61 36.58,25.14 35.56,26.16 35.56,27.3 35.25,27.62 U1.33
/CAN2_TX: length 28.4
  Top Layer w0.178: U1.34 35.28,28.12 35.94,27.46 35.94,26.32 36.96,25.3 36.96,21.53 38.73,19.75 38.73,9.02 43.55,4.2 43.55,4.18
/GPIOIN_0: length 22.5
  Top Layer w0.203: U1.61 26.32,38.83 25.55,39.6 25.37,39.6 23.45,41.53 21.84,41.53 19.05,44.32 19.05,48.51 J4.3
/GPIOIN_1: length 28.8
  Top Layer w0.203: 11.68,53.34 11.68,44.07 17.02,38.73 18.42,38.73 v1(18.8,38.35) ; U1.62 25.83,35.86 25.4,35.43 24.26,35.43 23.49,36.19 v1(23.49,36.96)
  Bottom Layer w0.203: v1(23.49,36.96) 20.19,36.96 v1(18.8,38.35)
/GPIOOUT_0: length 27.4
  Top Layer w0.178: U1.8 26.09,31.62 v1(26.32,31.4)
  Bottom Layer w0.178: J2.5 5,30.94 9.75,30.94 11.03,32.22 20.3,32.22 20.89,31.62 26.09,31.62 v1(26.32,31.4)
/GPIOOUT_1: length 26.5
  Top Layer w0.178: U1.9 25.06,31.12 v1(25.74,30.44)
  Bottom Layer w0.178: J2.4 5,28.4 21.07,28.4 23.11,30.44 v1(25.74,30.44)
/GPIOOUT_2: length 29.4
  Top Layer w0.178: U1.10 24.3,30.62 25.53,29.4 v1(25.53,29.34)
  Bottom Layer w0.178: J2.3 7.75,23.11 17.02,23.11 23.48,29.58 25.29,29.58 v1(25.53,29.34)
/GPIOOUT_3: length 28.1
  Top Layer w0.178: v1(24.64,28.7) 24.64,29.75 24.27,30.12 U1.11
  Bottom Layer w0.178: v1(24.64,28.7) 24.64,28.32 18.03,21.72 6.6,21.72 J2.2
/GPIOOUT_4: length 31.8
  Top Layer w0.178: U1.2 26.62,34.62 v1(26.8,34.8)
  Bottom Layer w0.178: v1(26.8,34.8) 25.32,36.27 24.05,36.27 23.86,36.08 13.83,36.08 J10.2
/GPIOOUT_5: length 31
  Top Layer w0.178: U1.3 26.13,34.12 v1(26.68,33.56)
  Bottom Layer w0.178: v1(26.68,33.56) 26.03,34.21 13.16,34.21 J10.3
/GPIOOUT_6: length 30
  Top Layer w0.178: U1.4 24.22,33.62 24.34,33.74 25.31,33.74 25.81,33.25 25.81,33.2 26.04,32.98 v1(26.04,32.51)
  Bottom Layer w0.178: v1(26.04,32.51) 26.04,32.98 25.17,33.84 10.99,33.84 J10.4
/OSC_IN: length 7.1
  Top Layer w0.254: U1.5 21.36,33.12 C22.1 ; 20.95,33.4 18.29,36.07 17.59,36.07 Y1.1
/OSC_OUT: length 6.7
  Top Layer w0.254: U1.6 21.44,32.62 C23.1 19.51,32.26 19.35,32.11 17.39,32.11 Y1.3
/POWER SUPPLY/BP: length 1.4
  Top Layer w0.508: C29.1 36.98,43.35 U4.4
/POWER SUPPLY/CC1USB: length 6.4
  Top Layer w0.297: R11.1 49.22,27.25 49.22,30.41 48.01,31.62 J23.A5
/POWER SUPPLY/CC2USB: length 6
  Top Layer w0.297: J23.B5 48.4,34.62 49.11,35.33 49.11,38.52 R12.1
/SPI1_MISO: length 26.9
  Top Layer w0.178: U1.22 27.32,22.88 25.9,21.46 24.99,21.46 20.57,17.04 20.57,9.26 15.49,4.18
/SPI1_MOSI: length 26.1
  Top Layer w0.178: 18.03,4.32 21.72,8 21.72,17.65 25.15,21.08 26.29,21.08 27.82,22.62 U1.23
/SPI1_NSS: length 30.3
  Top Layer w0.178: 10.41,4.18 10.41,11.08 17.5,18.16 20.62,18.16 24.68,22.22 25.26,22.22 26.32,23.28 U1.20
/SPI1_SCK: length 29.5
  Top Layer w0.178: U1.21 26.83,23.14 25.52,21.84 24.83,21.84 20.77,17.78 17.65,17.78 14.86,14.99 14.86,6.09 12.95,4.18
/SPI3_MISO: length 18.7
  Top Layer w0.178: J1.3 31.37,48.51 31.37,38.45 30.83,37.9 U1.52
/SPI3_MOSI: length 17.9
  Top Layer w0.178: U1.53 30.32,37.94 30.48,38.09 30.48,50.17 J1.2
/SPI3_NSS: length 20.4
  Top Layer w0.178: U1.50 31.83,37.84 33.15,39.16 33.15,45.21 J1.5
/SPI3_SCK: length 19.5
  Top Layer w0.178: U1.51 31.32,37.87 32.26,38.8 32.26,46.86 J1.4
/SW_BOOT0: length 1.6
  Top Layer w0.508: R7.1 23.11,53.9
/SWCLK: length 21.1
  Top Layer w0.298: v1(31.88,35.43) 32.33,35.88 U1.49
  Bottom Layer w0.298: J11.2 39.47,48.49 36.99,46.01 36.99,44.81 31.88,39.7 v1(31.88,35.43)
/SWDIO: length 21.1
  Top Layer w0.298: U1.46 32.94,34.12 v1(32.51,34.54)
  Bottom Layer w0.298: J11.1 40.29,43.71 40.29,43.54 32.81,36.06 32.81,34.84 v1(32.51,34.54)
/TIM2_CH2: length 22.1
  Top Layer w0.178: v1(30.23,29.21) 30.23,35.35 29.33,36.25 U1.55
  Bottom Layer w0.178: v1(30.23,29.21) 30.1,29.34 28.19,29.34 25.02,26.16 J8.3
/TIM2_CH3: length 7.4
  Top Layer w0.178: U1.29 30.83,24.67 30.1,23.94 30.1,19.45 J9.3
/TIM2_CH4: length 11.7
  Top Layer w0.178: v1(30.23,27.3) 30.32,27.21 U1.28
  Bottom Layer w0.178: v1(30.23,27.3) 31.5,26.03 31.5,21.24 J15.3
/TIM3_CH1: length 30.1
  Top Layer w0.178: U1.56 28.82,35.72 29.21,35.33 v1(29.21,28.45)
  Bottom Layer w0.178: J13.3 26.54,10.83 26.54,25.65 27.7,26.81 27.7,27.67 28.48,28.45 v1(29.21,28.45)
/TIM3_CH2: length 29.2
  Top Layer w0.178: v1(28.58,27.3) 27.94,27.94 27.94,35.05 28.33,35.44 U1.57
  Bottom Layer w0.178: J12.3 27.81,10.96 27.81,23.72 28.58,24.48 v1(28.58,27.3)
/TIM3_CH4: length 18.6
  Top Layer w0.178: U1.27 29.83,24.49 v1(29.21,23.88)
  Bottom Layer w0.178: v1(29.21,23.88) 29.21,22.48 31.62,20.07 31.62,12.83 33.91,10.54 J14.3
/USART1_RX: length 24.4
  Top Layer w0.298: U1.43 33.17,32.62 v1(32.51,33.27)
  Bottom Layer w0.298: J3.3 48.77,46.36 35.69,33.27 v1(32.51,33.27)
/USART1_TX: length 23.5
  Top Layer w0.298: U1.42 32.5,32.12 v1(32.39,32)
  Bottom Layer w0.298: 49.16,43.57 38.61,33.02 36.96,33.02 35.94,32 v1(32.39,32)
/USART2_RX: length 26.2
  Top Layer w0.254: U1.17 24.78,25.65 21.97,25.65 9.4,13.08 3.82,13.08
/USART2_TX: length 23.9
  Top Layer w0.254: J6.2 10.72,15.61 22.73,27.62
/USART6_RX: length 22.2
  Top Layer w0.178: J7.3 42.31,23.11 41.15,23.11 37.08,27.18 37.08,28.58 35.54,30.12 U1.38
/USART6_TX: length 23.5
  Top Layer w0.178: 49.67,13.2 37.97,24.89 37.97,25.53 36.7,26.8 36.7,28.42 35.51,29.62 U1.37
I2C1_SCL: length 14.2
  Top Layer w0.28: MT1.13 25.65,45.91 R1.2 v1(26.04,47.31) ; U1.58 27.82,38.62 v1(28.83,39.62)
  Bottom Layer w0.28: v1(26.04,47.31) 28.19,45.15 28.19,40.26 v1(28.83,39.62)
I2C1_SDA: length 13.7
  Top Layer w0.28: v1(27.32,39.73) U1.59 ; v1(24.77,47.31) R2.2 25.15,45.9 MT1.14
  Bottom Layer w0.28: v1(24.77,47.31) 24.77,46.86 25.65,45.97 25.65,44.7 27.32,43.03 v1(27.32,39.73)
I2C3_SCL: length 8.1
  Top Layer w0.254: U1.41 35.71,31.62 36.6,32.51 38.35,32.51 38.86,32 R5.2 40.14,30.22 U6.2
I2C3_SDA: length 6.3
  Top Layer w0.254: U1.40 35.81,31.12 37.59,29.34 ; 37.59,29.33 38.11,28.82 U6.4
NET-(D1-K): length 1.4
  Top Layer w0.508: R13.1 40.13,36.58 D1.1
NET-(D7-A): length 1.7
  Top Layer w0.889: 44.12,38.28 D7.2
NET-(U1-BOOT0): length 17.6
  Top Layer w0.203: U1.60 26.83,38.96 25.78,40.01 25.54,40.01 21.08,44.47 21.08,47.12 23.11,49.15 R7.2
NET-(U6-CSB): length 1.8
  Top Layer w0.254: U6.6 40.14,26.3
NRST: length 24.9
  Top Layer w0.178: U1.7 24.5,32.12 v1(24.89,32.51) ; v1(20.14,38.28) 20.14,38.6 C28.1
  Top Layer w0.508: C28.1 16.42,42.32 SW3.2 ; 8.47,43.85 10.33,43.85 v1(10.34,43.84) ; v1(14.73,43.81) 16.38,43.81
  In2.Cu w0.178: v1(24.89,32.51) 20.14,37.26 v1(20.14,38.28)
  Bottom Layer w0.508: v1(14.73,43.81) 14.71,43.84 v1(10.34,43.84)
TIM12_CH1: length 17.1
  Top Layer w0.178: J21.1 41.4,18.92 37.59,22.73 37.59,25.37 36.33,26.64 36.33,28.06 35.77,28.62 U1.35
TIM12_CH2: length 25.7
  Top Layer w0.178: U1.36 33.24,29.12 v1(32.64,29.72)
  Bottom Layer w0.178: v1(32.64,29.72) 32.27,30.08 27.8,30.08 21.97,24.26 21.97,19.54 J22.1
USB-D+: length 12.4
  Top Layer w0.2: 45.89,33.62 34.25,33.62
  Top Layer w0.203: 46.61,33.62 45.89,33.62
USB-D-: length 12.7
  Top Layer w0.2: U1.44 35.38,33.12 35.38,33.12 J23.A7

## Copper pours and planes (outline as drawn; the poured copper is in the pictures)
3V3 on Top Layer: -6.1,61.21 -5.46,-3.18 59.69,-3.81 58.42,62.1
/POWER SUPPLY/5VIN on Top Layer: 42.21,41 41.25,40.94 40.77,40.92 39.98,40.97 38.81,41.02 38.81,41.66 40.03,41.66 40.82,41.58 41.22,41.58 42.04,42.01 42.95,42.01 43,41.05
GND on Top Layer: 21.29,30 22.12,29.46 23.7,29.44 23.7,29.79 22.15,29.79 21.34,30.63 19.58,30.66 19.58,30
GND on Bottom Layer: -3.94,60.2 58.42,60.83 59.56,-3.43 -5.08,-3.81
GND on Bottom Layer: 39.93,42.62 40.41,42.82 41.02,43.61 41.96,43.64 42.7,43.59 42.82,43.41 42.82,42.67 42.65,42.55 41.15,41.94 40.64,41.94 39.98,41.96 38.76,41.96 38.66,42.09 38.68,42.52 38.76,42.62
GND on In1.Cu: -4.57,60.83 57.4,61.34 57.66,-2.29 -4.32,-0.89
GND on In2.Cu: 25.15,36.25 25.5,36.25 25.53,37.8 25.58,38.3 25.55,38.91 24.08,40.41 23.32,40.61 22.58,40.61 21.39,40.44 21.21,40.13 21.39,39.78 22.68,39.67 23.39,39.67 23.95,39.57 24.92,38.73 24.94,38.33 25.12,37.77
VCC (+5) on In2.Cu: -5.33,61.21 58.67,61.47 59.56,-3.68 -5.33,-3.56
/FBEADOUT on Top Layer: 22.23,28.98 21.36,29.03 19.63,29.03 18.77,29.08 18.06,29.08 17.96,29.29 17.96,30 18.11,30.1 18.77,30.1 19.69,29.69 21.36,29.69 22.17,29.26 23.6,29.26 23.6,28.98
/VCAP on Top Layer: 30.86,23.29 30.86,24.16 31.19,24.97 31.19,26.47 31.52,26.47 31.52,24.92 31.88,24.16 31.88,23.29 30.94,23.27

## Text on the board
Top Silkscreen Layer: +3V3 | GPO4 | GPO5 | GPO6 | GND | GPO0 | GPO1 | GPO2 | GPO3 | TX | RX | NSS | GPI1 | ADC1 | ADC2 | SCK | GPI0 | MISO | MOSI | +5 | T12C2 | G | T2C2 | T3C1 | T2C3 | T3C2 | T2C4 | T3C4 | SWCLK | T12C1 | SWDIO | made by chandan for fpv drone :) | UART2 | RESET | SPI1 | ESC2 | BOOT | SPI3 | SWD | CAN2 | ESC1 | UART1 | UART6
